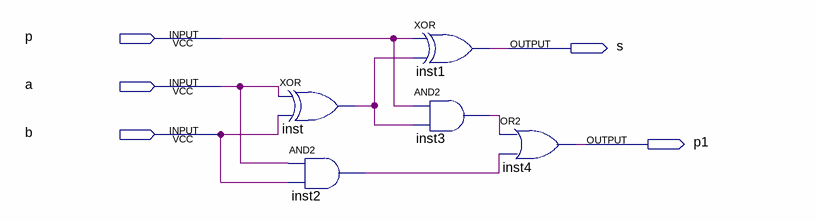
[diagram p0: schematic sheet]
// Quartus schematic sum1.bdf as structural Verilog: 5 symbols, 5 pins
module sum1 (
  input  p,
  input  a,
  input  b,
  output s,
  output p1
);

  wire inst2_out, inst3_out, inst_out;

  xor inst (inst_out, a, b);
  and inst2 (inst2_out, a, b);
  xor inst1 (s, p, inst_out);
  and inst3 (inst3_out, p, inst_out);
  or inst4 (p1, inst3_out, inst2_out);
endmodule
